# Altium project ETH_M_V1.PrjPcb
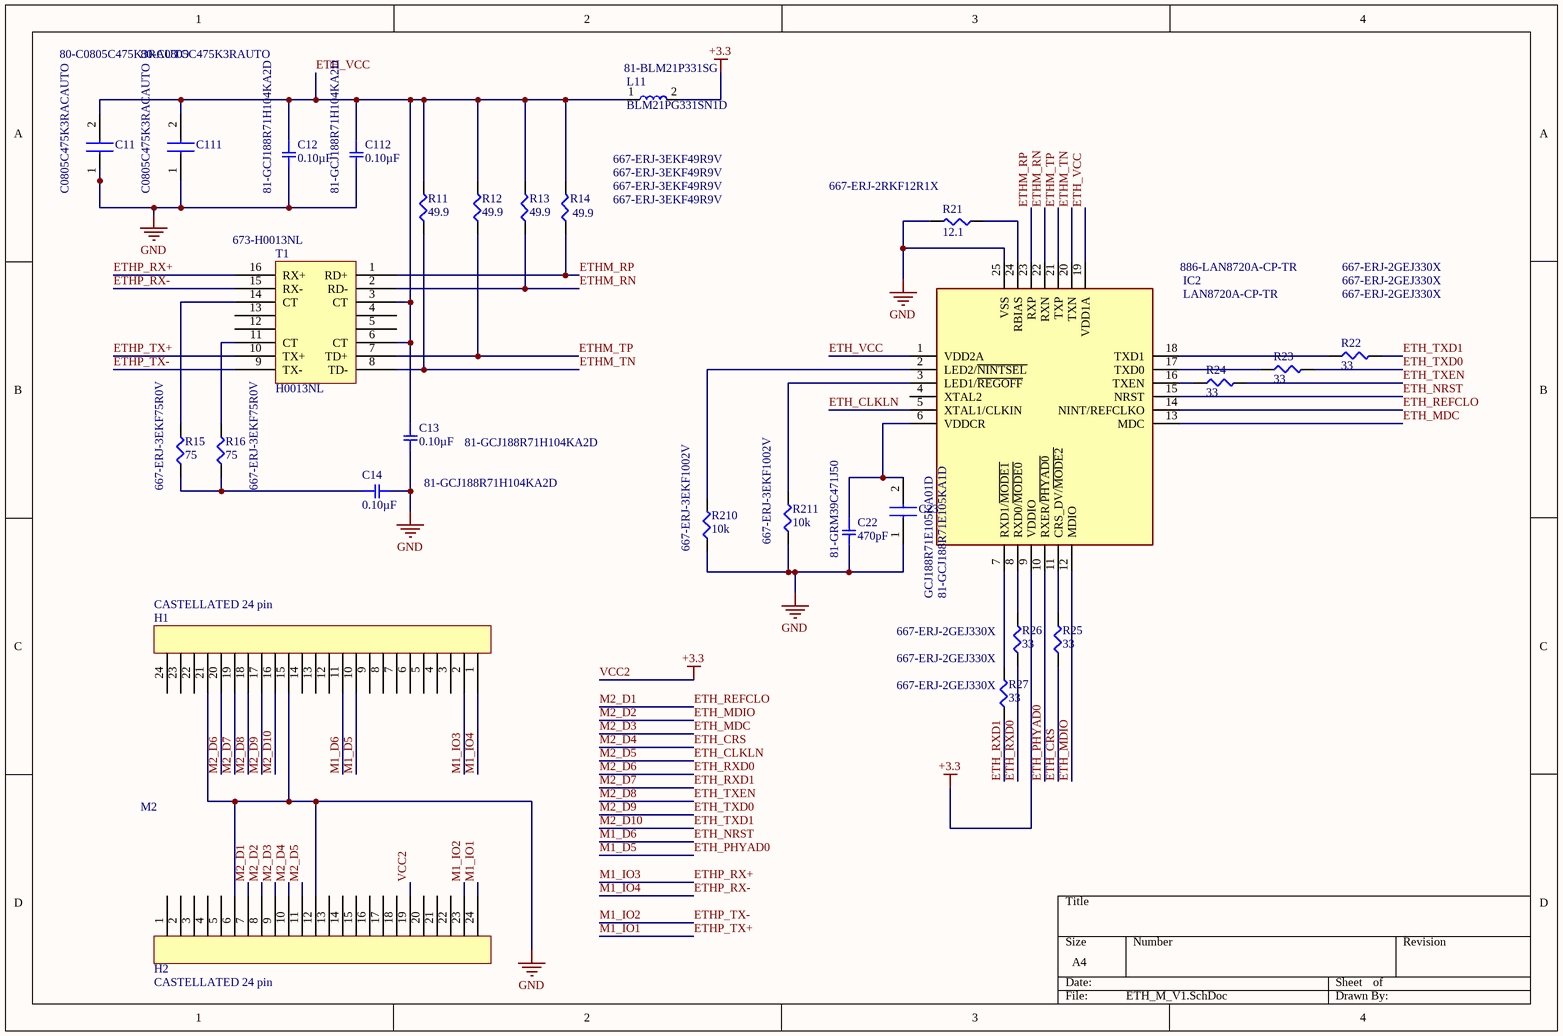
[diagram p0: ETH_M_V1.SchDoc]
1 sheet, 28 parts. Net scope: global (net labels, ports and power ports of the same name join across sheets).
Board file: ETH_M_V1.PcbDoc

## Sheet ETH_M_V1.SchDoc
size A4

### Parts
C11  C0805C475K3RACAUTO  Supplier Part Number 1: 80-C0805C475K3RAUTO  [CAPC2012X125N]
C12  0.10µF  Supplier Part Number 1: 81-GCJ188R71H104KA2D  [SMD-0603C]
C13  0.10µF  Supplier Part Number 1: 81-GCJ188R71H104KA2D  [SMD-0603C]
C14  0.10µF  Supplier Part Number 1: 81-GCJ188R71H104KA2D  [SMD-0603C]
C22  470pF  Supplier Part Number 1: 81-GRM39C471J50  [SMD-0603C]
C23  GCJ188R71E105KA01D  Supplier Part Number 1: 81-GCJ188R71E105KA1D  [CAPC1608X100N]
C111  C0805C475K3RACAUTO  Supplier Part Number 1: 80-C0805C475K3RAUTO  [CAPC2012X125N]
C112  0.10µF  Supplier Part Number 1: 81-GCJ188R71H104KA2D  [SMD-0603C]
H1  CASTELLATED 24 pin  [CASTELLATED 24 pin]
H2  CASTELLATED 24 pin  [CASTELLATED 24 pin]
IC2  LAN8720A-CP-TR  Supplier Part Number 1: 886-LAN8720A-CP-TR  [QFN50P400X400X100-25N-D]
L11  BLM21PG331SN1D  Supplier Part Number 1: 81-BLM21P331SG  [INDC2012X87]
R11  49.9  Supplier Part Number 1: 667-ERJ-3EKF49R9V  [SMD-0603-RES]
R12  49.9  Supplier Part Number 1: 667-ERJ-3EKF49R9V  [SMD-0603-RES]
R13  49.9  Supplier Part Number 1: 667-ERJ-3EKF49R9V  [SMD-0603-RES]
R14  49.9  Supplier Part Number 1: 667-ERJ-3EKF49R9V  [SMD-0603-RES]
R15  75  Supplier Part Number 1: 667-ERJ-3EKF75R0V  [SMD-0603-RES]
R16  75  Supplier Part Number 1: 667-ERJ-3EKF75R0V  [SMD-0603-RES]
R21  12.1  Supplier Part Number 1: 667-ERJ-2RKF12R1X  [SMD-0402-RES]
R22  33  Supplier Part Number 1: 667-ERJ-2GEJ330X  [SMD-0402-RES]
R23  33  Supplier Part Number 1: 667-ERJ-2GEJ330X  [SMD-0402-RES]
R24  33  Supplier Part Number 1: 667-ERJ-2GEJ330X  [SMD-0402-RES]
R25  33  Supplier Part Number 1: 667-ERJ-2GEJ330X  [SMD-0402-RES]
R26  33  Supplier Part Number 1: 667-ERJ-2GEJ330X  [SMD-0402-RES]
R27  33  Supplier Part Number 1: 667-ERJ-2GEJ330X  [SMD-0402-RES]
R210  10k  Supplier Part Number 1: 667-ERJ-3EKF1002V  [SMD-0603-RES]
R211  10k  Supplier Part Number 1: 667-ERJ-3EKF1002V  [SMD-0603-RES]
T1  H0013NL  Supplier Part Number 1: 673-H0013NL  [H0013NL]

### Nets
GND: C11.1 C12.2 C13.2 C14.2 C22.2 C23.1 C111.1 C112.2 H1.15 H1.21 H2.6 H2.12 IC2.25(VSS) R21.2 R210.1 R211.1
VCC2: H2.19 IC2.9(VDDIO) L11.2  [also labelled +3.3]
ETH_CLKLN: H2.11 IC2.5(XTAL1/CLKIN)  [also labelled M2_D5]
ETH_CRS: H2.10 R25.1  [also labelled M2_D4]
ETH_MDC: H2.9 IC2.13(MDC)  [also labelled M2_D3]
ETH_MDIO: H2.8 IC2.12(MDIO)  [also labelled M2_D2]
ETH_NRST: H1.11 IC2.15(NRST)  [also labelled M1_D6]
ETH_PHYAD0: H1.10 IC2.10(RXER/~{PHYAD0})  [also labelled M1_D5]
ETH_REFCLO: H2.7 IC2.14(NINT/REFCLKO)  [also labelled M2_D1]
ETH_RXD0: H1.20 R26.1  [also labelled M2_D6]
ETH_RXD1: H1.19 R27.1  [also labelled M2_D7]
ETH_TXD0: H1.17 R23.2  [also labelled M2_D9]
ETH_TXD1: H1.16 R22.2  [also labelled M2_D10]
ETH_TXEN: H1.18 R24.2  [also labelled M2_D8]
ETH_VCC: C11.2 C12.1 C13.1 C111.2 C112.1 IC2.1(VDD2A) IC2.19(VDD1A) L11.1 R11.2 R12.2 R13.2 R14.2 T1.3(CT) T1.6(CT)
ETHM_RN: IC2.22(RXN) R13.1 T1.2(RD-)
ETHM_RP: IC2.23(RXP) R14.1 T1.1(RD+)
ETHM_TN: IC2.20(TXN) R11.1 T1.8(TD-)
ETHM_TP: IC2.21(TXP) R12.1 T1.7(TD+)
ETHP_RX+: H1.2 T1.16(RX+)  [also labelled M1_IO3]
ETHP_RX-: H1.1 T1.15(RX-)  [also labelled M1_IO4]
ETHP_TX+: H2.24 T1.10(TX+)  [also labelled M1_IO1]
ETHP_TX-: H2.23 T1.9(TX-)  [also labelled M1_IO2]
NetC14_1: C14.1 R15.1 R16.1
NetC22_1: C22.1 C23.2 IC2.6(VDDCR)
NetIC2_2: IC2.2(LED2/~{NINTSEL}) R210.2
NetIC2_3: IC2.3(LED1/~{REGOFF}) R211.2
NetIC2_7: IC2.7(RXD1/~{MODE1}) R27.2
NetIC2_8: IC2.8(RXD0/~{MODE0}) R26.2
NetIC2_11: IC2.11(CRS_DV/~{MODE2}) R25.2
NetIC2_16: IC2.16(TXEN) R24.1
NetIC2_17: IC2.17(TXD0) R23.1
NetIC2_18: IC2.18(TXD1) R22.1
NetIC2_24: IC2.24(RBIAS) R21.1
NetR15_2: R15.2 T1.14(CT)
NetR16_2: R16.2 T1.11(CT)

Not connected (* = marked no-connect by the designer): H1 3 4 5 6 7 8 9 12 13 14 22 23 24; H2 1 2 3 4 5 13 14 15 16 17 18 20 21 22; IC2 4(XTAL2); T1 4 5 12 13

### Notes on the sheet
- M2

### Library data of the parts
C11 C111 = C0805C475K3RACAUTO: Capacitor; Manufacturer_Name: Kemet; Datasheet Link: https://componentsearchengine.com/Datasheets/1/C0805C475K3RACAUTO.pdf; Height: 1.25mm; Mouser2 Part Number: 80-C0805C475K3RAUTO; Mouser2 Price/Stock: https://www.mouser.com/Search/Refine.aspx?Keyword=80-C0805C475K3RAUTO; Manufacturer_Part_Number: C0805C475K3RACAUTO; Supplier 1: Mouser
C12-C14 C112 = GCJ188R71H104KA12D: CAP CER 0.1UF 50V X7R 0603; Manufacturer: Murata Electronics North America; Factory Stock: 0; Unit Price (USD): 0.12; Minimum Quantity: 1; Tolerance: ±10%; Datasheets: http://www.murata.com/~/media/webrenewal/support/library/catalog/products/capacitor/mlcc/c03e.ashx; Image: //media.digikey.com/Renders/Murata%20Renders/0603%28LQG18%29.jpg; Digi-Key Part Number: 490-5798-1-ND; Part Number: GCJ188R71H104KA12D; Quantity Available: 163695; @ qty: 0; Packaging: Cut Tape (CT); Series: GCJ; Part Status: Active; Value: 0.10µF; Voltage: 50V; Temperature Coefficient: X7R; Operating Temperature: -55°C ~ 125°C; Features: Soft Termination; Ratings: AEC-Q200; Applications: Automotive, Boardflex Sensitive; Mounting Type: Surface Mount, MLCC; Package / Case: 0603 (1608 Metric); Size / Dimension: 0.063" L x 0.031" W (1.60mm x 0.80mm); Height - Seated (Max): -; Thickness (Max): 0.035" (0.90mm); Lead Spacing: -; Lead Style: -; Supplier 1: Mouser
C22 = GRM1885C1H471JA01D: CAP CER 470PF 50V NP0 0603; Manufacturer: Murata Electronics North America; Factory Stock: 0; Unit Price (USD): 0.11; Minimum Quantity: 1; Tolerance: ±5%; Temperature Coefficient: C0G, NP0; Datasheets: http://www.murata.com/~/media/webrenewal/support/library/catalog/products/capacitor/mlcc/c02e.pdf; Image: //media.digikey.com/Renders/Murata%20Renders/ZRB-SERIES-0402.jpg; Digi-Key Part Number: 490-1443-1-ND; Part Number: GRM1885C1H471JA01D; Quantity Available: 472909; @ qty: 0; Packaging: Cut Tape (CT); Series: GRM; Part Status: Active; Value: 470pF; Voltage: 50V; Operating Temperature: -55°C ~ 125°C; Features: -; Ratings: -; Applications: General Purpose; Mounting Type: Surface Mount, MLCC; Package / Case: 0603 (1608 Metric); Size / Dimension: 0.063" L x 0.031" W (1.60mm x 0.80mm); Height - Seated (Max): -; Thickness (Max): 0.035" (0.90mm); Lead Spacing: -; Lead Style: -; Supplier 1: Mouser
C23 = GCJ188R71E105KA01D: Capacitor; Manufacturer_Name: Murata Electronics; Datasheet Link: https://psearch.en.murata.com/capacitor/product/GCJ188R71E105KA01%23.html; Height: 1mm; Manufacturer_Part_Number: GCJ188R71E105KA01D; Supplier 1: Mouser
IC2 = LAN8720A-CP-TR: Integrated Circuit; Manufacturer_Name: Microchip; Datasheet Link: https://componentsearchengine.com/Datasheets/1/LAN8720A-CP-TR.pdf; Height: 1mm; Mouser2 Part Number: 886-LAN8720A-CP-TR; Mouser2 Price/Stock: https://www.mouser.com/Search/Refine.aspx?Keyword=886-LAN8720A-CP-TR; Manufacturer_Part_Number: LAN8720A-CP-TR; Supplier 1: Mouser
L11 = BLM21PG331SN1D: Ferrite Beads Multi-Layer 330Ohm 25% 100MHz 1.5A 70mOhm DCR 0805 Paper T/R; MF: Murata; Digi-Key_Part_Number: 490-5988-1-ND; SnapEDA_Link: https://www.snapeda.com/parts/BLM21PG331SN1D/Murata%20Electronics%20North%20America/view-part/?ref=snap; Package: 0805 Murata; MP: BLM21PG331SN1D; Digi-Key_Purchase_URL: https://www.digikey.ru/product-detail/en/murata-electronics-north-america/BLM21PG331SN1D/490-5988-1-ND/3845188?utm_source=snapeda&utm_medium=aggregator&utm_campaign=symbol; Value: *; Supplier 1: Mouser
R11-R14 = ERJ-3EKF49R9V: RES SMD 49.9 OHM 1% 1/10W 0603; Manufacturer: Panasonic Electronic Components; Factory Stock: 0; Unit Price (USD): 0.00379; @ qty: 1500; Minimum Quantity: 1; Power (Watts): 0.1W, 1/10W; Temperature Coefficient: ±100ppm/°C; Part Number: ERJ-3EKF49R9V; Datasheets: http://industrial.panasonic.com/www-cgi/jvcr13pz.cgi?E+PZ+3+AOA0002+ERJ3EKF49R9V+7+WW; Image: //media.digikey.com/Photos/Panasonic%20Photos/MFG_ERJ-P6W%20Series.jpg; Digi-Key Part Number: P49.9HCT-ND; Quantity Available: 566023; Packaging: Cut Tape (CT); Series: ERJ; Part Status: Active; Value: 49.9; Tolerance: ±1%; Composition: Thick Film; Features: Automotive AEC-Q200; Operating Temperature: -55°C ~ 155°C; Package / Case: 0603 (1608 Metric); Supplier Device Package: 0603; Size / Dimension: 0.063" L x 0.031" W (1.60mm x 0.80mm); Height - Seated (Max): 0.022" (0.55mm); Number of Terminations: 2; Failure Rate: -; Supplier 1: Mouser
R15 R16 = ERJ-3EKF75R0V: RES SMD 75 OHM 1% 1/10W 0603; Manufacturer: Panasonic Electronic Components; Factory Stock: 0; Unit Price (USD): 0.00379; @ qty: 1500; Minimum Quantity: 1; Power (Watts): 0.1W, 1/10W; Temperature Coefficient: ±100ppm/°C; Part Number: ERJ-3EKF75R0V; Datasheets: http://industrial.panasonic.com/www-cgi/jvcr13pz.cgi?E+PZ+3+AOA0002+ERJ3EKF75R0V+7+WW; Image: //media.digikey.com/Photos/Panasonic%20Photos/MFG_ERJ-P6W%20Series.jpg; Digi-Key Part Number: P75.0HCT-ND; Quantity Available: 236923; Packaging: Cut Tape (CT); Series: ERJ; Part Status: Active; Value: 75; Tolerance: ±1%; Composition: Thick Film; Features: Automotive AEC-Q200; Operating Temperature: -55°C ~ 155°C; Package / Case: 0603 (1608 Metric); Supplier Device Package: 0603; Size / Dimension: 0.063" L x 0.031" W (1.60mm x 0.80mm); Height - Seated (Max): 0.022" (0.55mm); Number of Terminations: 2; Failure Rate: -; Supplier 1: Mouser
R21 = ERJ-2RKF12R1X: RES SMD 12.1 OHM 1% 1/10W 0402; Manufacturer: Panasonic Electronic Components; Factory Stock: 0; Unit Price (USD): 0.00408; @ qty: 1500; Minimum Quantity: 1; Power (Watts): 0.1W, 1/10W; Temperature Coefficient: ±100ppm/°C; Part Number: ERJ-2RKF12R1X; Datasheets: http://industrial.panasonic.com/www-cgi/jvcr13pz.cgi?E+PZ+3+AOA0002+ERJ2RKF12R1X+7+WW; Image: //media.digikey.com/Photos/Panasonic%20Photos/ERJ-PA2-Series.jpg; Digi-Key Part Number: P12.1LCT-ND; Quantity Available: 33252; Packaging: Cut Tape (CT); Series: ERJ; Part Status: Active; Value: 12.1; Tolerance: ±1%; Composition: Thick Film; Features: Automotive AEC-Q200; Operating Temperature: -55°C ~ 155°C; Package / Case: 0402 (1005 Metric); Supplier Device Package: 0402; Size / Dimension: 0.039" L x 0.020" W (1.00mm x 0.50mm); Height - Seated (Max): 0.016" (0.40mm); Number of Terminations: 2; Failure Rate: -; Supplier 1: Mouser
R22-R27 = ERJ-2GEJ330X: RES SMD 33 OHM 5% 1/10W 0402; Manufacturer: Panasonic Electronic Components; Factory Stock: 0; Unit Price (USD): 0.00350; @ qty: 1500; Minimum Quantity: 1; Power (Watts): 0.1W, 1/10W; Temperature Coefficient: ±200ppm/°C; Part Number: ERJ-2GEJ330X; Datasheets: http://industrial.panasonic.com/www-cgi/jvcr13pz.cgi?E+PZ+3+AOA0001+ERJ2GEJ330X+7+WW; Image: //media.digikey.com/Photos/Panasonic%20Photos/ERJ-PA2-Series.jpg; Digi-Key Part Number: P33JCT-ND; Quantity Available: 857104; Packaging: Cut Tape (CT); Series: ERJ; Part Status: Active; Value: 33; Tolerance: ±5%; Composition: Thick Film; Features: Automotive AEC-Q200; Operating Temperature: -55°C ~ 155°C; Package / Case: 0402 (1005 Metric); Supplier Device Package: 0402; Size / Dimension: 0.039" L x 0.020" W (1.00mm x 0.50mm); Height - Seated (Max): 0.016" (0.40mm); Number of Terminations: 2; Failure Rate: -; Supplier 1: Mouser
R210 R211 = ERJ-3EKF1002V: RES SMD 10K OHM 1% 1/10W 0603; Manufacturer: Panasonic Electronic Components; Factory Stock: 0; Unit Price (USD): 0.00379; @ qty: 1500; Minimum Quantity: 1; Power (Watts): 0.1W, 1/10W; Temperature Coefficient: ±100ppm/°C; Part Number: ERJ-3EKF1002V; Datasheets: http://industrial.panasonic.com/www-cgi/jvcr13pz.cgi?E+PZ+3+AOA0002+ERJ3EKF1002V+7+WW; Image: //media.digikey.com/Photos/Panasonic%20Photos/MFG_ERJ-P6W%20Series.jpg; Digi-Key Part Number: P10.0KHCT-ND; Quantity Available: 6703141; Packaging: Cut Tape (CT); Series: ERJ; Part Status: Active; Value: 10k; Tolerance: ±1%; Composition: Thick Film; Features: Automotive AEC-Q200; Operating Temperature: -55°C ~ 155°C; Package / Case: 0603 (1608 Metric); Supplier Device Package: 0603; Size / Dimension: 0.063" L x 0.031" W (1.60mm x 0.80mm); Height - Seated (Max): 0.022" (0.55mm); Number of Terminations: 2; Failure Rate: -; Supplier 1: Mouser
T1 = H0013NL: Transformer; Manufacturer_Name: Pulse; Datasheet Link: https://productfinder.pulseeng.com/products/datasheets/H304.pdf; Height: 1mm; Manufacturer_Part_Number: H0013NL; Supplier 1: Mouser